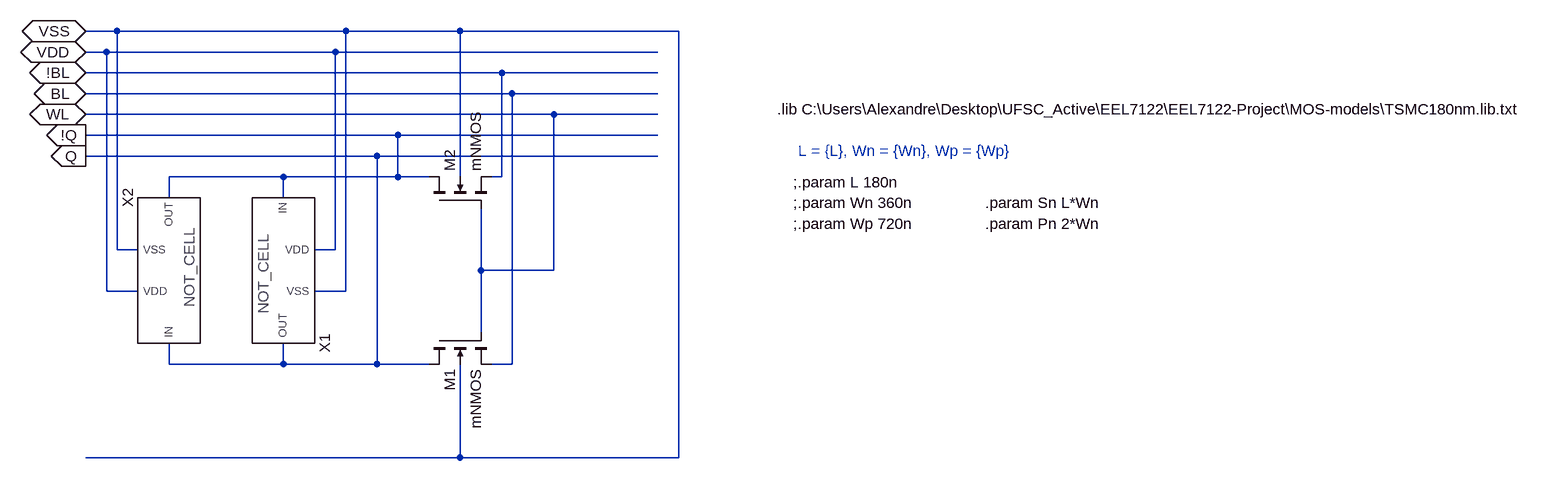
[diagram p0: schematic CELL_SRAM.asc]
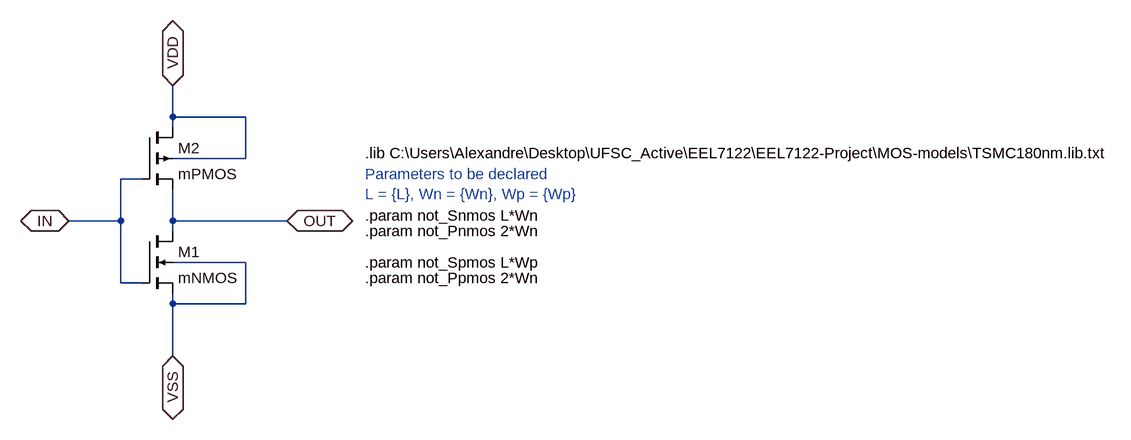
[diagram p1: sub-circuit not_cell.asc]
CELL_SRAM.asc, the LTspice schematic file:
Version 4
SHEET 1 2260 680
WIRE -16 -160 -64 -160
WIRE 336 -160 -16 -160
WIRE 512 -160 336 -160
WIRE 848 -160 512 -160
WIRE -32 -128 -64 -128
WIRE 320 -128 -32 -128
WIRE 816 -128 320 -128
WIRE 576 -96 -64 -96
WIRE 816 -96 576 -96
WIRE 592 -64 -64 -64
WIRE 816 -64 592 -64
WIRE 656 -32 -64 -32
WIRE 816 -32 656 -32
WIRE 416 0 -64 0
WIRE 816 0 416 0
WIRE 384 32 -64 32
WIRE 816 32 384 32
WIRE 240 64 64 64
WIRE 416 64 416 0
WIRE 416 64 240 64
WIRE 464 64 416 64
WIRE 512 64 512 -160
WIRE 576 64 576 -96
WIRE 576 64 560 64
WIRE 64 96 64 64
WIRE 240 96 240 64
WIRE -16 176 -16 -160
WIRE 16 176 -16 176
WIRE 320 176 320 -128
WIRE 320 176 288 176
WIRE 544 208 544 112
WIRE 656 208 656 -32
WIRE 656 208 544 208
WIRE -32 240 -32 -128
WIRE 16 240 -32 240
WIRE 336 240 336 -160
WIRE 336 240 288 240
WIRE 544 304 544 208
WIRE 64 352 64 320
WIRE 240 352 240 320
WIRE 240 352 64 352
WIRE 384 352 384 32
WIRE 384 352 240 352
WIRE 464 352 384 352
WIRE 592 352 592 -64
WIRE 592 352 560 352
WIRE 512 496 512 352
WIRE 512 496 -64 496
WIRE 848 496 848 -160
WIRE 848 496 512 496
FLAG -64 -128 VDD
IOPIN -64 -128 BiDir
FLAG -64 -160 VSS
IOPIN -64 -160 BiDir
FLAG -64 -96 !BL
IOPIN -64 -96 BiDir
FLAG -64 -64 BL
IOPIN -64 -64 BiDir
FLAG -64 -32 WL
IOPIN -64 -32 BiDir
FLAG -64 0 !Q
IOPIN -64 0 Out
FLAG -64 32 Q
IOPIN -64 32 Out
SYMBOL NOT_CELL 240 208 R90
SYMATTR InstName X1
SYMATTR SpiceLine L = {L}, Wn = {Wn}, Wp = {Wp}
SYMBOL NOT_CELL 64 208 R270
SYMATTR InstName X2
SYMATTR SpiceLine L = {L}, Wn = {Wn}, Wp = {Wp}
SYMBOL nmos4 464 304 M90
SYMATTR InstName M1
SYMATTR Value2 l={L} w={Wn} ad={Sn} as={Sn} pd={Pn} ps={Pn} m=1
SYMATTR Value mNMOS
SYMBOL nmos4 464 112 R270
SYMATTR InstName M2
SYMATTR Value2 l={L} w={Wn} ad={Sn} as={Sn} pd={Pn} ps={Pn} m=1
SYMATTR Value mNMOS
TEXT 1000 -40 Left 2 !.lib C:\\Users\\Alexandre\\Desktop\\UFSC_Active\\EEL7122\\EEL7122-Project\\MOS-models\\TSMC180nm.lib.txt
TEXT 1032 24 Left 2 ;L = {L}, Wn = {Wn}, Wp = {Wp}
TEXT 1024 72 Left 2 !;.param L 180n
TEXT 1024 104 Left 2 !;.param Wn 360n
TEXT 1024 136 Left 2 !;.param Wp 720n
TEXT 1320 104 Left 2 !.param Sn L*Wn
TEXT 1320 136 Left 2 !.param Pn 2*Wn

not_cell.asc, the sub-circuit schematic file:
Version 4
SHEET 1 1132 680
WIRE -592 -32 -592 -80
WIRE -480 -32 -592 -32
WIRE -592 -16 -592 -32
WIRE -480 32 -480 -32
WIRE -480 32 -592 32
WIRE -640 64 -672 64
WIRE -672 128 -672 64
WIRE -672 128 -752 128
WIRE -592 128 -592 80
WIRE -416 128 -592 128
WIRE -592 144 -592 128
WIRE -480 192 -592 192
WIRE -672 224 -672 128
WIRE -640 224 -672 224
WIRE -592 256 -592 240
WIRE -480 256 -480 192
WIRE -480 256 -592 256
WIRE -592 336 -592 256
FLAG -752 128 IN
IOPIN -752 128 BiDir
FLAG -416 128 OUT
IOPIN -416 128 BiDir
FLAG -592 336 VSS
IOPIN -592 336 BiDir
FLAG -592 -80 VDD
IOPIN -592 -80 BiDir
SYMBOL nmos4 -640 144 R0
SYMATTR InstName M1
SYMATTR Value mNMOS
SYMATTR Value2 l={L} w={Wn} ad={not_Snmos} as={not_Snmos} pd={not_Pnmos} ps={not_Pnmos} m=1
SYMBOL pmos4 -640 -16 R0
SYMATTR InstName M2
SYMATTR Value mPMOS
SYMATTR Value2 l={L} w={WP} ad={not_Spmos} as={not_Spmos} pd={not_Ppmos} ps={not_Ppmos} m=1
TEXT -296 24 Left 2 !.lib C:\\Users\\Alexandre\\Desktop\\UFSC_Active\\EEL7122\\EEL7122-Project\\MOS-models\\TSMC180nm.lib.txt
TEXT -296 192 Left 2 !.param not_Spmos L*Wp
TEXT -296 216 Left 2 !.param not_Ppmos 2*Wn
TEXT -296 120 Left 2 !.param not_Snmos L*Wn
TEXT -296 144 Left 2 !.param not_Pnmos 2*Wn
TEXT -296 56 Left 2 ;Parameters to be declared\nL = {L}, Wn = {Wn}, Wp = {Wp}

The netlist it stands for:
* CELL_SRAM.asc
XX1 !Q Q VDD VSS not_cell params: L = {L}, Wn = {Wn}, Wp = {Wp}
XX2 Q !Q VDD VSS not_cell params: L = {L}, Wn = {Wn}, Wp = {Wp}
M1 Q WL BL VSS mNMOS l={L} w={Wn} ad={Sn} as={Sn} pd={Pn} ps={Pn} m=1
M2 !Q WL !BL VSS mNMOS l={L} w={Wn} ad={Sn} as={Sn} pd={Pn} ps={Pn} m=1

* block symbol definitions
.subckt not_cell IN OUT VDD VSS
M1 OUT IN VSS VSS mNMOS l={L} w={Wn} ad={not_Snmos} as={not_Snmos} pd={not_Pnmos} ps={not_Pnmos} m=1
M2 VDD IN OUT VDD mPMOS l={L} w={WP} ad={not_Spmos} as={not_Spmos} pd={not_Ppmos} ps={not_Ppmos} m=1
.lib C:\Users\Alexandre\Desktop\UFSC_Active\EEL7122\EEL7122-Project\MOS-models\TSMC180nm.lib.txt
.param not_Spmos L*Wp
.param not_Ppmos 2*Wn
.param not_Snmos L*Wn
.param not_Pnmos 2*Wn
* Parameters to be declared
* L = {L}, Wn = {Wn}, Wp = {Wp}
.ends not_cell

.model NMOS NMOS
.model PMOS PMOS
.lib standard.mos
.lib C:\Users\Alexandre\Desktop\UFSC_Active\EEL7122\EEL7122-Project\MOS-models\TSMC180nm.lib.txt
* L = {L}, Wn = {Wn}, Wp = {Wp}
;.param L 180n
;.param Wn 360n
;.param Wp 720n
.param Sn L*Wn
.param Pn 2*Wn
.backanno
.end